# Altium schematic sheet 02_MCU_ESP32P4.SchDoc: MCU_ESP32P4
size A3; DrawnBy: YILDIRIM_DOGRU
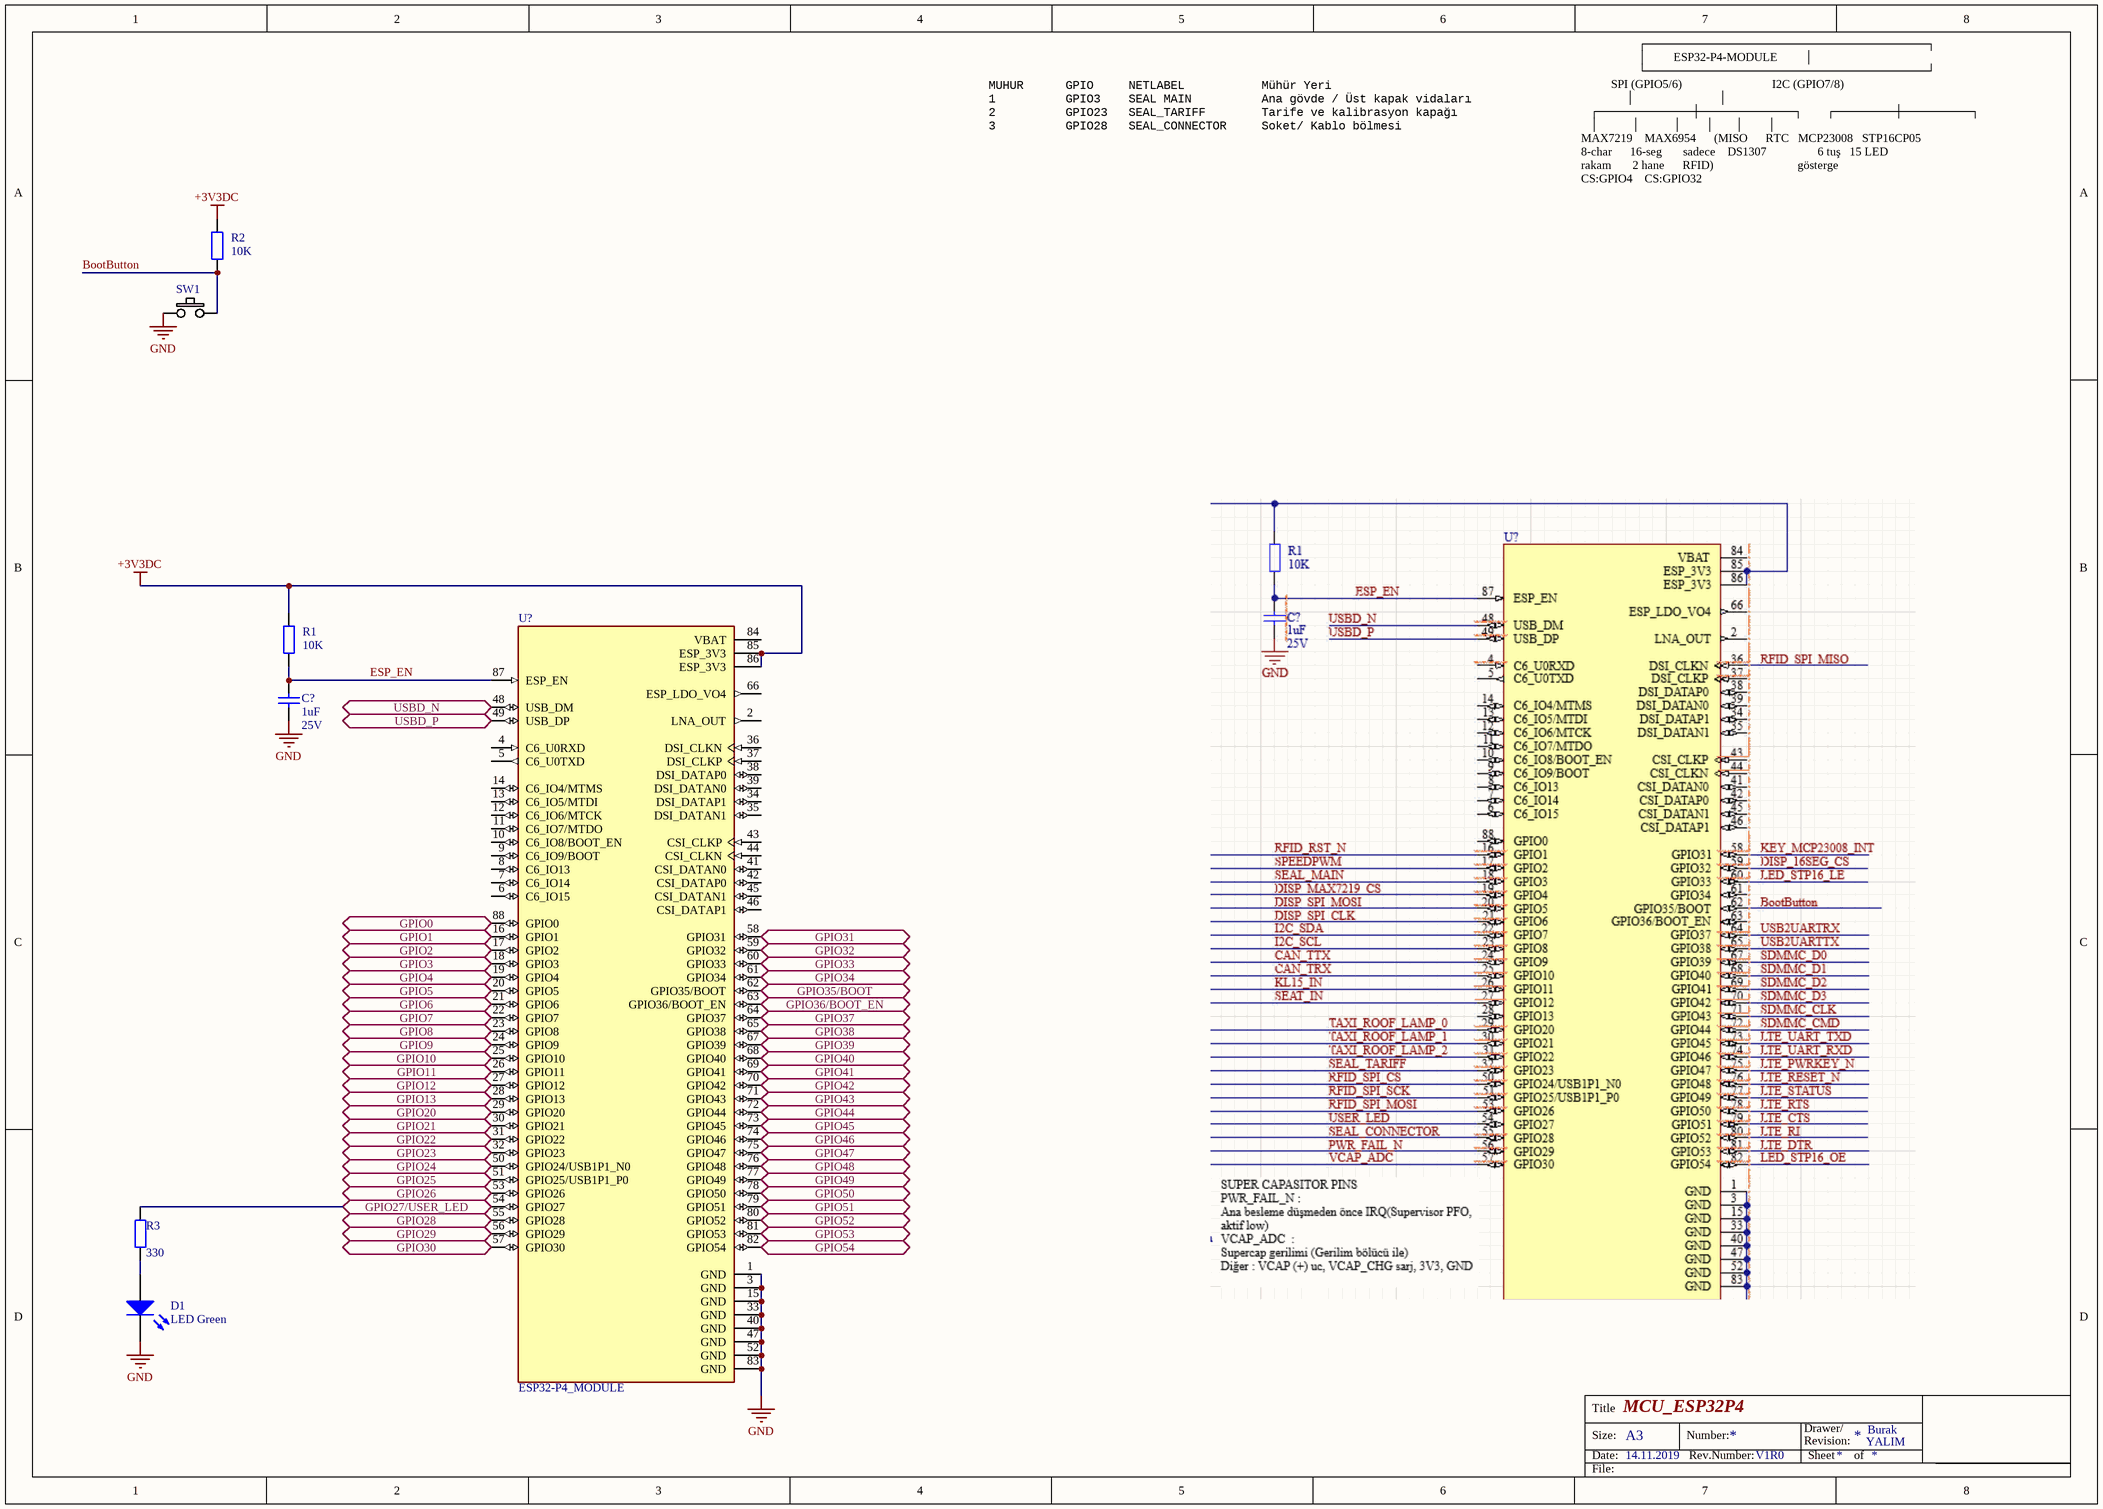
[diagram p0: 02_MCU_ESP32P4.SchDoc]

## Parts
C?  value 1uF  Voltage: 25V  [CAP_0603]  (hidden comment: CL10A105KA8NNNC)
D1  LED Green  [LED-1]
R1  value 10K  [AXIAL-0.4]  (hidden comment: R_CS)
R2  value 10K  [AXIAL-0.4]  (hidden comment: R_CS)
R3  value 330  [AXIAL-0.4]  (hidden comment: RG)
SW1  SW-PB-BLACK-SMD  [SW-PB-SMD]  (value not drawn)
U?  ESP32-P4_MODULE  [XCVR_ESP32-P4_MODULE]

## Ports
GPIO0 (bidir), GPIO1 (bidir), GPIO2 (bidir), GPIO3 (bidir), GPIO4 (bidir), GPIO5 (bidir), GPIO6 (bidir), GPIO7 (bidir), GPIO8 (bidir), GPIO9 (bidir), GPIO10 (bidir), GPIO11 (bidir), GPIO12 (bidir), GPIO13 (bidir), GPIO20 (bidir), GPIO21 (bidir), GPIO22 (bidir), GPIO23 (bidir), GPIO24 (bidir), GPIO25 (bidir), GPIO26 (bidir), GPIO27/USER_LED (bidir), GPIO28 (bidir), GPIO29 (bidir), GPIO30 (bidir), GPIO31 (bidir), GPIO32 (bidir), GPIO33 (bidir), GPIO34 (bidir), GPIO35/BOOT (bidir), GPIO36/BOOT_EN (bidir), GPIO37 (bidir), GPIO38 (bidir), GPIO39 (bidir), GPIO40 (bidir), GPIO41 (bidir), GPIO42 (bidir), GPIO43 (bidir), GPIO44 (bidir), GPIO45 (bidir), GPIO46 (bidir), GPIO47 (bidir), GPIO48 (bidir), GPIO49 (bidir), GPIO50 (bidir), GPIO51 (bidir), GPIO52 (bidir), GPIO53 (bidir), GPIO54 (bidir), USBD_N (bidir), USBD_P (bidir)

## Nets
+3V3DC: R1.2 R2.2 U?.85(ESP_3V3) U?.86(ESP_3V3)
GND: C?.2 D1.2(K) SW1.1 U?.1(GND) U?.3(GND) U?.15(GND) U?.33(GND) U?.40(GND) U?.47(GND) U?.52(GND) U?.83(GND)
BootButton: R2.1 SW1.2
ESP_EN: C?.1 R1.1 U?.87(ESP_EN)
GPIO0: U?.88(GPIO0) ; port GPIO0
GPIO1: U?.16(GPIO1) ; port GPIO1
GPIO2: U?.17(GPIO2) ; port GPIO2
GPIO3: U?.18(GPIO3) ; port GPIO3
GPIO4: U?.19(GPIO4) ; port GPIO4
GPIO5: U?.20(GPIO5) ; port GPIO5
GPIO6: U?.21(GPIO6) ; port GPIO6
GPIO7: U?.22(GPIO7) ; port GPIO7
GPIO8: U?.23(GPIO8) ; port GPIO8
GPIO9: U?.24(GPIO9) ; port GPIO9
GPIO10: U?.25(GPIO10) ; port GPIO10
GPIO11: U?.26(GPIO11) ; port GPIO11
GPIO12: U?.27(GPIO12) ; port GPIO12
GPIO13: U?.28(GPIO13) ; port GPIO13
GPIO20: U?.29(GPIO20) ; port GPIO20
GPIO21: U?.30(GPIO21) ; port GPIO21
GPIO22: U?.31(GPIO22) ; port GPIO22
GPIO23: U?.32(GPIO23) ; port GPIO23
GPIO24: U?.50(GPIO24/USB1P1_N0) ; port GPIO24
GPIO25: U?.51(GPIO25/USB1P1_P0) ; port GPIO25
GPIO26: U?.53(GPIO26) ; port GPIO26
GPIO27/USER_LED: R3.2 U?.54(GPIO27) ; port GPIO27/USER_LED
GPIO28: U?.55(GPIO28) ; port GPIO28
GPIO29: U?.56(GPIO29) ; port GPIO29
GPIO30: U?.57(GPIO30) ; port GPIO30
GPIO31: U?.58(GPIO31) ; port GPIO31
GPIO32: U?.59(GPIO32) ; port GPIO32
GPIO33: U?.60(GPIO33) ; port GPIO33
GPIO34: U?.61(GPIO34) ; port GPIO34
GPIO35/BOOT: U?.62(GPIO35/BOOT) ; port GPIO35/BOOT
GPIO36/BOOT_EN: U?.63(GPIO36/BOOT_EN) ; port GPIO36/BOOT_EN
GPIO37: U?.64(GPIO37) ; port GPIO37
GPIO38: U?.65(GPIO38) ; port GPIO38
GPIO39: U?.67(GPIO39) ; port GPIO39
GPIO40: U?.68(GPIO40) ; port GPIO40
GPIO41: U?.69(GPIO41) ; port GPIO41
GPIO42: U?.70(GPIO42) ; port GPIO42
GPIO43: U?.71(GPIO43) ; port GPIO43
GPIO44: U?.72(GPIO44) ; port GPIO44
GPIO45: U?.73(GPIO45) ; port GPIO45
GPIO46: U?.74(GPIO46) ; port GPIO46
GPIO47: U?.75(GPIO47) ; port GPIO47
GPIO48: U?.76(GPIO48) ; port GPIO48
GPIO49: U?.77(GPIO49) ; port GPIO49
GPIO50: U?.78(GPIO50) ; port GPIO50
GPIO51: U?.79(GPIO51) ; port GPIO51
GPIO52: U?.80(GPIO52) ; port GPIO52
GPIO53: U?.81(GPIO53) ; port GPIO53
GPIO54: U?.82(GPIO54) ; port GPIO54
USBD_N: U?.48(USB_DM) ; port USBD_N
USBD_P: U?.49(USB_DP) ; port USBD_P
NetD1_1: D1.1(A) R3.1

Not connected (* = marked no-connect by the designer): U? 2(LNA_OUT) 4(C6_U0RXD) 5(C6_U0TXD) 6(C6_IO15) 7(C6_IO14) 8(C6_IO13) 9(C6_IO9/BOOT) 10(C6_IO8/BOOT_EN) 11(C6_IO7/MTDO) 12(C6_IO6/MTCK) 13(C6_IO5/MTDI) 14(C6_IO4/MTMS) 34(DSI_DATAP1) 35(DSI_DATAN1) 36(DSI_CLKN) 37(DSI_CLKP) 38(DSI_DATAP0) 39(DSI_DATAN0) 41(CSI_DATAN0) 42(CSI_DATAP0) 43(CSI_CLKP) 44(CSI_CLKN) 45(CSI_DATAN1) 46(CSI_DATAP1) 66(ESP_LDO_VO4) 84(VBAT)

## Notes on the sheet
- MUHUR      GPIO     NETLABEL           Mühür Yeri
  1          GPIO3    SEAL MAIN          Ana gövde / Üst kapak vidaları
  2          GPIO23   SEAL_TARIFF        Tarife ve kalibrasyon kapağı
  3          GPIO28   SEAL_CONNECTOR     Soket/ Kablo bölmesi
- ┌─────────────────────────────────┐
  │         ESP32-P4-MODULE         │
  └─────────────────────────────────┘
  SPI (GPIO5/6)                              I2C (GPIO7/8)
  │                            │
  ┌───────────┼───────────┐        ┌───────┼────────┐
  │           │           │        │       │        │
  MAX7219    MAX6954      (MISO      RTC   MCP23008   STP16CP05
  8-char      16-seg       sadece    DS1307                 6 tuş   15 LED
  rakam       2 hane      RFID)                            gösterge
  CS:GPIO4    CS:GPIO32
- Title
- Size:
- Date:
- 14.11.2019
- A3
- Number:
- Rev.Number:
- V1R0
- Revision:
- Drawer/
- Sheet
- of
- YALIM
- Burak
- File:

## Library data of the parts
C? = C01757: CAP CER 1UF 25VDC %10 X5R SMD; Manufacturer: Samsung; Manufacturer Part Number: CL10A105KA8NNNC
D1 = LED1: Typical RED GaAs LED; Published: 8-Jun-2000; LatestRevisionDate: 08-Jul-2005; LatestRevisionNote: Mech Layer 1 removed.; PackageReference: LED-1; Publisher: Altium Limited; PackageDescription: LED; 2 Leads
R1-R3 = Res2: Resistor; Published: 8-Jun-2000; LatestRevisionDate: 17-Jul-2002; LatestRevisionNote: Re-released for DXP Platform.; PackageReference: AXIAL-0.4; Publisher: Altium Limited; PackageDescription: Axial Device, Thru-Hole; 2 Leads; 0.4 in Pin Spacing
SW1 = SW-PB-BLACK-SMD: PUSHBUTTON SWITCH 6MM SMD
U? = ESP32-P4_MODULE: Dual-core RISC-V high-performance module ESP32-C6H8; Manufacturer: Waveshare Electronics; Manufacturer Part Number: ESP32-P4 Module; Value: *